# EAGLE design Adafruit Trellis 4x4 3mm HT16K33 (EAGLE 9.6.2)
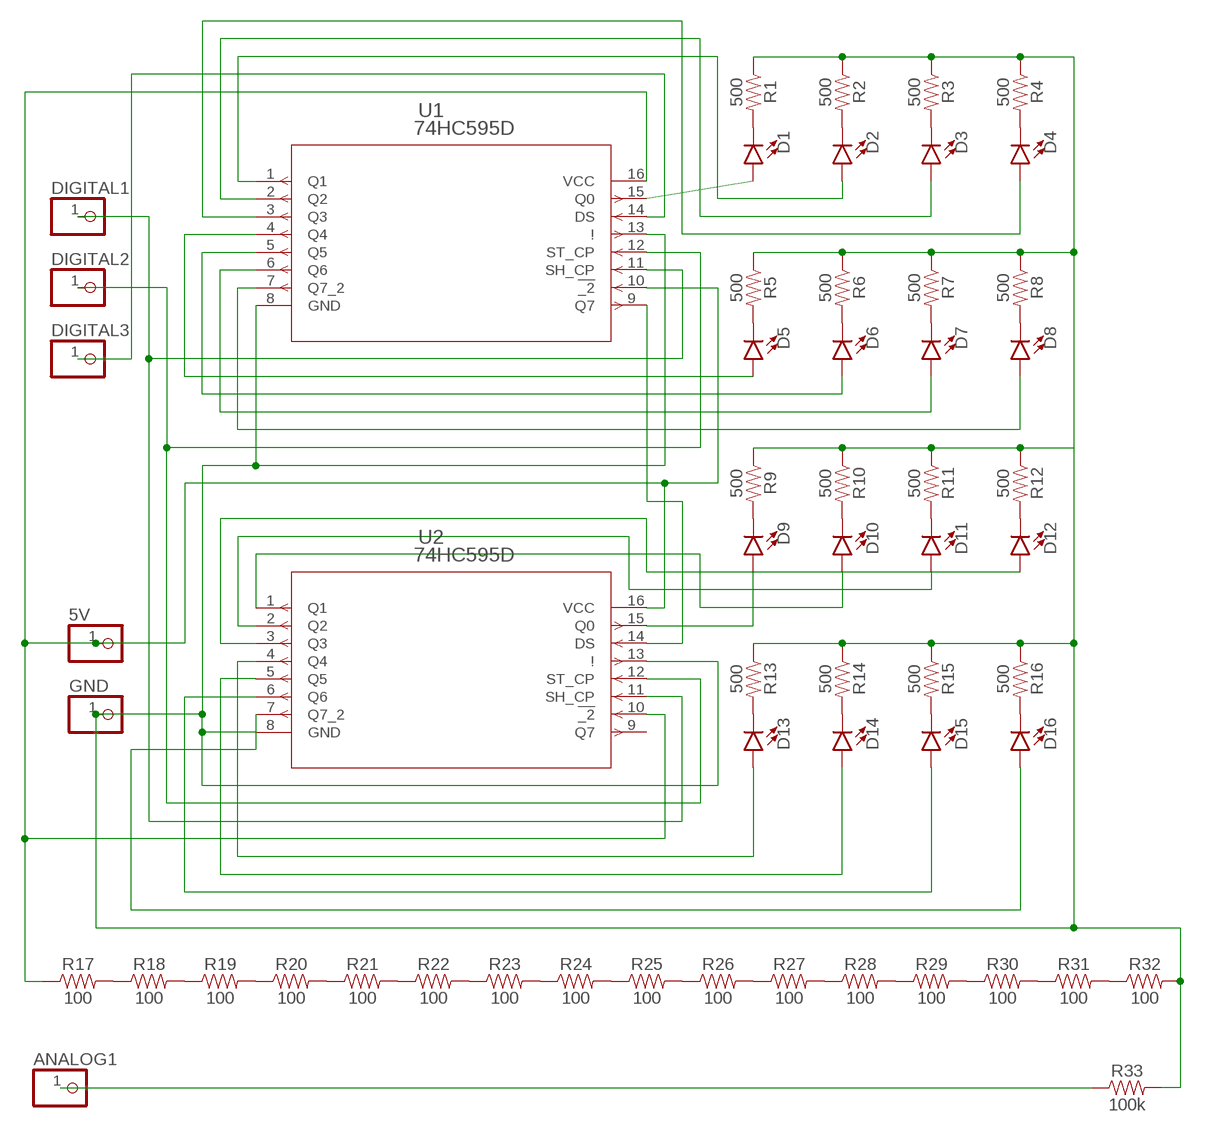
[diagram p0: schematic, sheet 1]

## Parts
5V  PINHD-1X1  [1X01]
ANALOG1  PINHD-1X1  [1X01]
D1  LED3MM  [LED_3MM]
D2  LED3MM  [LED_3MM]
D3  LED3MM  [LED_3MM]
D4  LED3MM  [LED_3MM]
D5  LED3MM  [LED_3MM]
D6  LED3MM  [LED_3MM]
D7  LED3MM  [LED_3MM]
D8  LED3MM  [LED_3MM]
D9  LED3MM  [LED_3MM]
D10  LED3MM  [LED_3MM]
D11  LED3MM  [LED_3MM]
D12  LED3MM  [LED_3MM]
D13  LED3MM  [LED_3MM]
D14  LED3MM  [LED_3MM]
D15  LED3MM  [LED_3MM]
D16  LED3MM  [LED_3MM]
DIGITAL1  PINHD-1X1  [1X01]
DIGITAL2  PINHD-1X1  [1X01]
DIGITAL3  PINHD-1X1  [1X01]
GND  PINHD-1X1  [1X01]
R1  500  RESISTOR0603  [0603]
R2  500  RESISTOR0603  [0603]
R3  500  RESISTOR0603  [0603]
R4  500  RESISTOR0603  [0603]
R5  500  RESISTOR0603  [0603]
R6  500  RESISTOR0603  [0603]
R7  500  RESISTOR0603  [0603]
R8  500  RESISTOR0603  [0603]
R9  500  RESISTOR0603  [0603]
R10  500  RESISTOR0603  [0603]
R11  500  RESISTOR0603  [0603]
R12  500  RESISTOR0603  [0603]
R13  500  RESISTOR0603  [0603]
R14  500  RESISTOR0603  [0603]
R15  500  RESISTOR0603  [0603]
R16  500  RESISTOR0603  [0603]
R17  100  100OHM-0603-1/10W-1%  [0603]
R18  100  100OHM-0603-1/10W-1%  [0603]
R19  100  100OHM-0603-1/10W-1%  [0603]
R20  100  100OHM-0603-1/10W-1%  [0603]
R21  100  100OHM-0603-1/10W-1%  [0603]
R22  100  100OHM-0603-1/10W-1%  [0603]
R23  100  100OHM-0603-1/10W-1%  [0603]
R24  100  100OHM-0603-1/10W-1%  [0603]
R25  100  100OHM-0603-1/10W-1%  [0603]
R26  100  100OHM-0603-1/10W-1%  [0603]
R27  100  100OHM-0603-1/10W-1%  [0603]
R28  100  100OHM-0603-1/10W-1%  [0603]
R29  100  100OHM-0603-1/10W-1%  [0603]
R30  100  100OHM-0603-1/10W-1%  [0603]
R31  100  100OHM-0603-1/10W-1%  [0603]
R32  100  100OHM-0603-1/10W-1%  [0603]
R33  100k  100KOHM-0603-1/10W-1%  [0603]
U1  74HC595D  [SOT109-1_NXP]
U2  74HC595D  [SOT109-1_NXP]

## Nets
N$1: R17.2 R18.1
N$2: ANALOG1.1 R33.1
N$3: DIGITAL3.1 U1.14(DS)
N$4: D11.A U2.2(Q2)
N$5: DIGITAL2.1 U1.12(ST_CP) U2.12(ST_CP)
N$6: D1.K(C) R1.2
N$7: D2.K(C) R2.2
N$8: GND.1 R1.1 R2.1 R3.1 R4.1 R5.1 R6.1 R7.1 R8.1 R9.1 R10.1 R11.1 R12.1 R13.1 R14.1 R15.1 R16.1 R32.2 R33.2 U1.8(GND) U1.13(!) U2.8(GND) U2.13(!)
N$9: D3.K(C) R3.2
N$10: D4.K(C) R4.2
N$11: D5.K(C) R5.2
N$12: D6.K(C) R6.2
N$13: D7.K(C) R7.2
N$14: D1.A U1.15(Q0)
N$15: D8.K(C) R8.2
N$16: D9.K(C) R9.2
N$17: D10.K(C) R10.2
N$18: D11.K(C) R11.2
N$19: D12.K(C) R12.2
N$20: D13.K(C) R13.2
N$21: D14.K(C) R14.2
N$22: D15.K(C) R15.2
N$23: D16.K(C) R16.2
N$24: D5.A U1.4(Q4)
N$25: D2.A U1.1(Q1)
N$26: D3.A U1.2(Q2)
N$27: D4.A U1.3(Q3)
N$28: U1.9(Q7) U2.14(DS)
N$29: D6.A U1.5(Q5)
N$30: D7.A U1.6(Q6)
N$31: D8.A U1.7(Q7_2)
N$32: D13.A U2.4(Q4)
N$33: D10.A U2.1(Q1)
N$35: 5V.1 R17.1 U1.10(!_2) U1.16(VCC) U2.10(!_2) U2.16(VCC)
N$36: D12.A U2.3(Q3)
N$37: R18.2 R19.1
N$38: D9.A U2.15(Q0)
N$39: D14.A U2.5(Q5)
N$40: R19.2 R20.1
N$41: D15.A U2.6(Q6)
N$42: R20.2 R21.1
N$43: R21.2 R22.1
N$44: R22.2 R23.1
N$45: R23.2 R24.1
N$46: R24.2 R25.1
N$47: R25.2 R26.1
N$48: R26.2 R27.1
N$49: R27.2 R28.1
N$50: R28.2 R29.1
N$51: R29.2 R30.1
N$52: R30.2 R31.1
N$53: R31.2 R32.1
N$54: D16.A U2.7(Q7_2)
N$55: DIGITAL1.1 U1.11(SH_CP) U2.11(SH_CP)
Unconnected: U2.9(Q7)

## Library data of the parts
5V ANALOG1 DIGITAL1-DIGITAL3 GND = adafruit:PINHD-1X1: Pin header 1x1 for 0.1" spacing With round pins
D1-D16 = SparkFun-LED:LED: LED (Generic) Standard schematic elements and footprints for 5mm, 3mm, 1206, and 0603 sized LEDs. Generic LEDs with no color specified.; PROD_ID: DIO-08794
R1-R16 = SparkFun-Resistors:RESISTOR: Generic Resistor Package
R17-R32 = SparkFun-Resistors:100OHM: 100Ω resistor A resistor is a passive two-terminal electrical component that implements electrical resistance as a circuit element. Resistors act to reduce current flow, and, at the same time, act to lower voltage levels within circuits. - Wikipedia; PROD_ID: RES-07863
R33 = SparkFun-Resistors:100KOHM: 100kΩ resistor A resistor is a passive two-terminal electrical component that implements electrical resistance as a circuit element. Resistors act to reduce current flow, and, at the same time, act to lower voltage levels within circuits. - Wikipedia; PROD_ID: RES-07828
U1 U2 = Shift_Register:74HC595D; COPYRIGHT: Copyright (C) 2022 Ultra Librarian. All rights reserved.; DIGI-KEY_PART_NUMBER_1: 1727-3796-ND; DIGI-KEY_PART_NUMBER_2: 568-1483-1-ND; DIGI-KEY_PART_NUMBER_3: 568-1483-2-ND; DIGI-KEY_PART_NUMBER_4: 568-1483-6-ND; DIGI-KEY_PART_NUMBER_5: 568-3968-5-ND; DIGI-KEY_PART_NUMBER_6: 74HC595DCT-ND; DIGI-KEY_PART_NUMBER_7: 74HC595DDKR-ND; DIGI-KEY_PART_NUMBER_8: 74HC595DTR-ND; MANUFACTURER_PART_NUMBER: 74HC595D; MFR_NAME: NXP

## Board
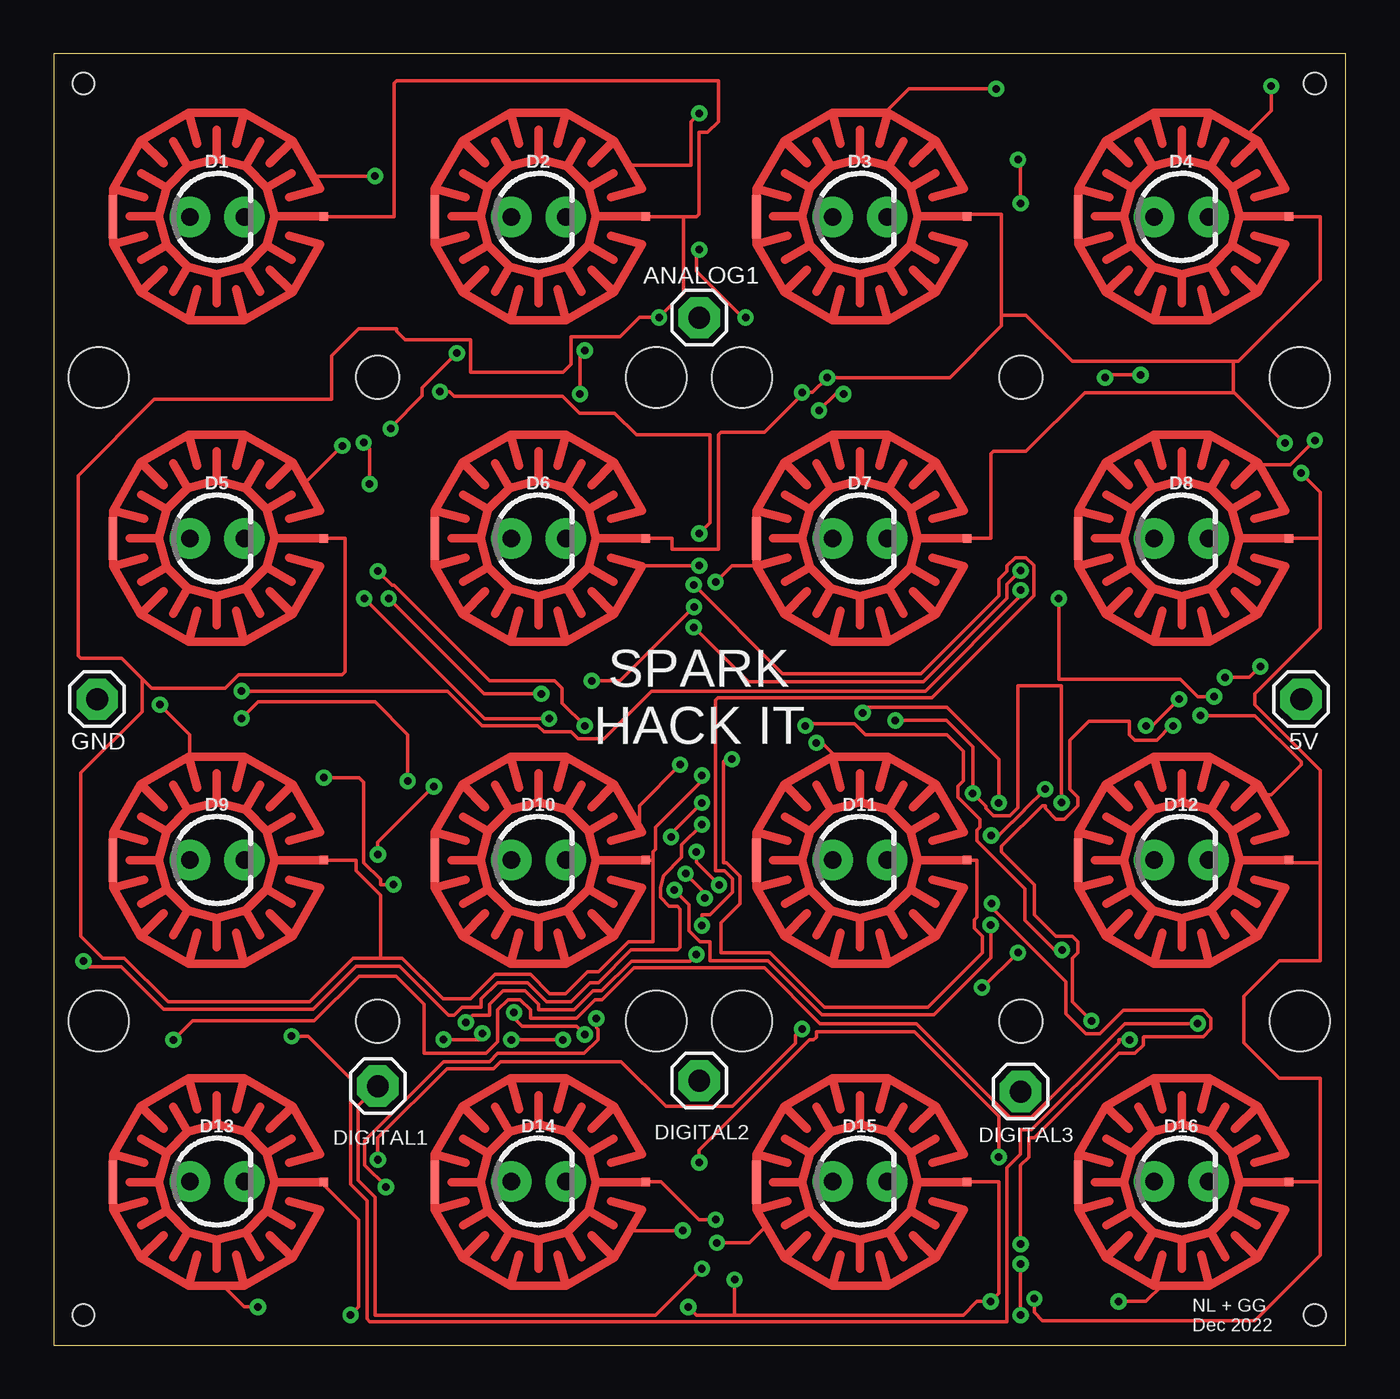
[diagram p1: board, top side]
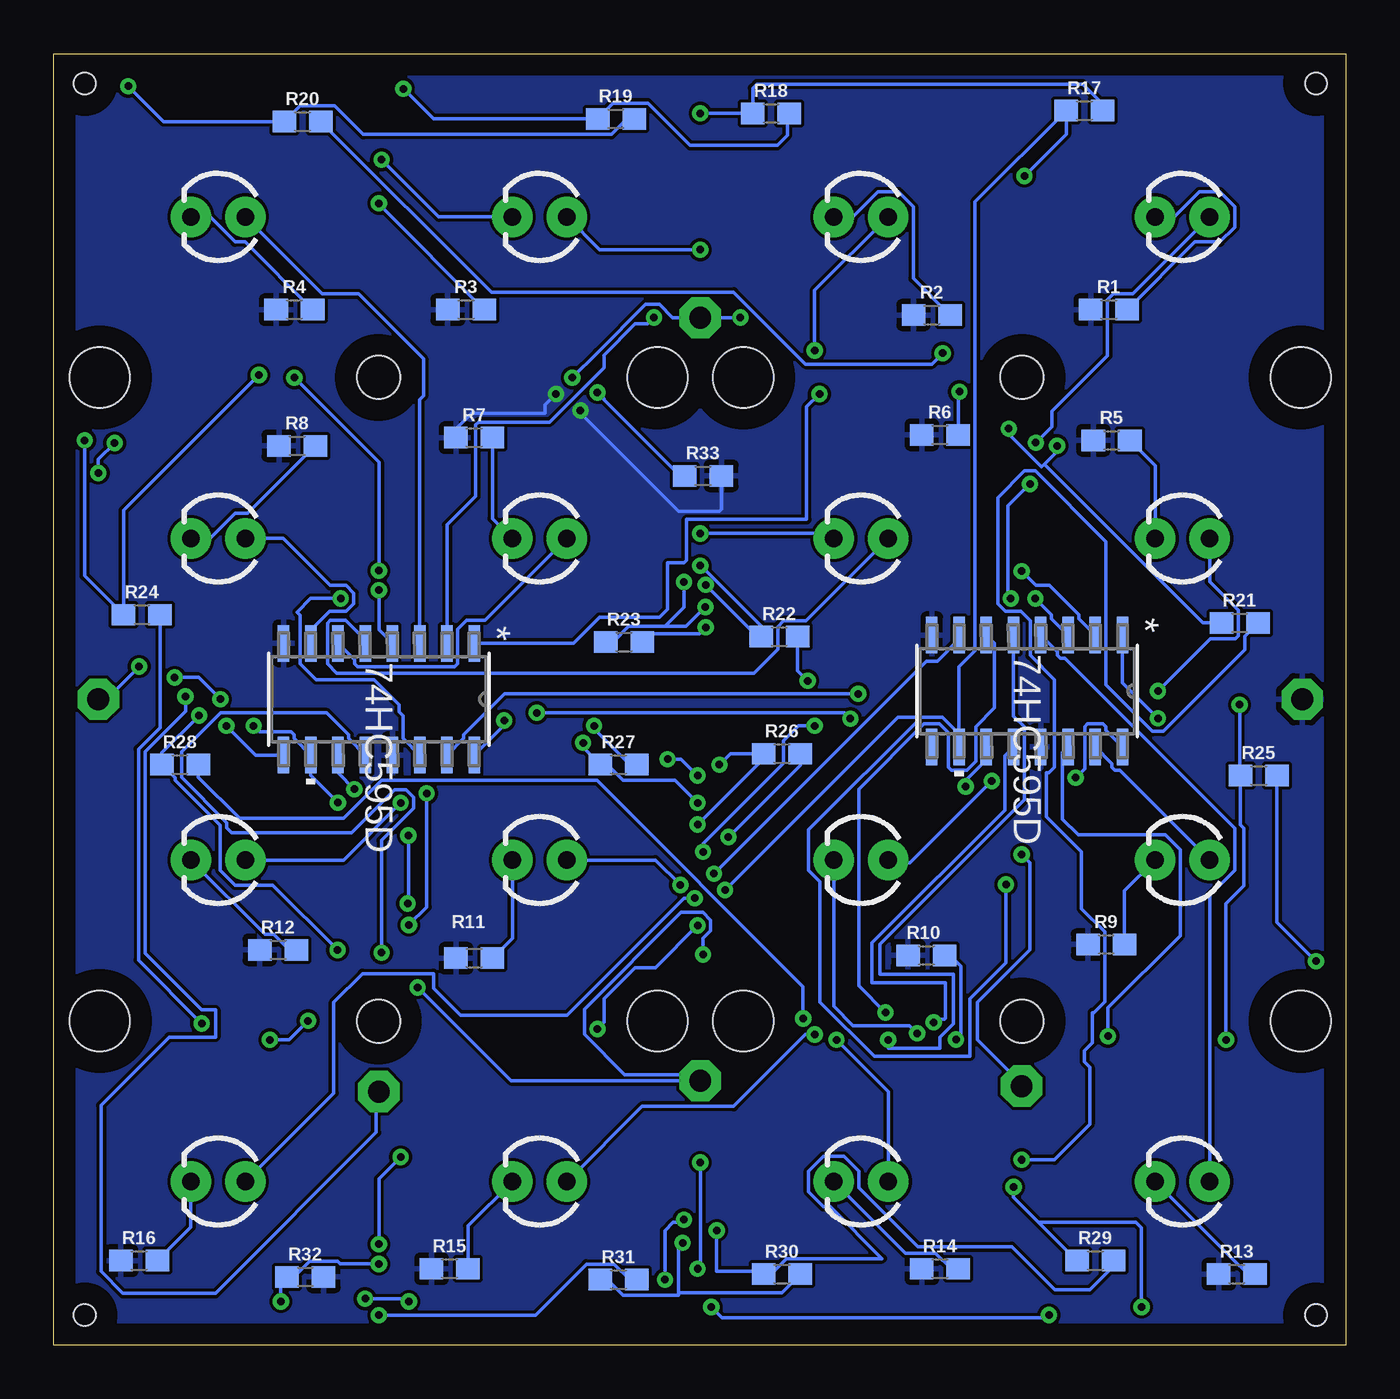
[diagram p2: board, bottom side, seen from below]

Size 60.25 x 60.19 mm. Coordinates in mm from the lower left corner, seen from the top.
Outline: 0,0 60.25,0 60.25,60.19 0,60.19 0,0
Copper layers (1*16): Top 0.035mm / dielectric 1.5mm / Bottom 0.035mm
Design rules "default": minimum track width 6mil, minimum drill 0.35mm, track to track 6mil, track to pad 6mil, pad to pad 6mil, via to via 6mil, smd to smd 6mil, copper to edge 40mil, drill to drill 6mil, minimum pad ring 10mil, minimum via ring 8mil, stop-mask expansion 4mil, vias tented up to drill 0mil, thermal gap 10mil

### Footprints (pad centres in the part's own frame; a part is rotated, then mirrored left to right if it is on the bottom)
1X01 = drill 1.016 pad 1.93 octagon: 1 0,0
LED_3MM = drill 0.813 pad 1.88: A -1.27,0; K 1.27,0
ELAST_PAD_SQUARE_10MM_5.4MM_4X4GRID = smd 0.4 x 0.4: A1 -17.5,-22.5; A2 -2.5,-22.5; A3 12.5,-22.5; A4 27.5,-22.5; A5 -17.5,-7.5; A6 -2.5,-7.5; A7 12.5,-7.5; A8 27.5,-7.5; A9 -17.5,7.5; A10 -2.5,7.5; A11 12.5,7.5; A12 27.5,7.5; A13 -17.5,22.5; A14 -2.5,22.5; A15 12.5,22.5; A16 27.5,22.5 | smd 0.4 x 2: B1 -27.33,-22.51; B2 -12.33,-22.51; B3 2.67,-22.51; B4 17.67,-22.51; B5 -27.33,-7.51; B6 -12.33,-7.51; B7 2.67,-7.51; B8 17.67,-7.51; B9 -27.33,7.49; B10 -12.33,7.49; B11 2.67,7.49; B12 17.67,7.49; B13 -27.33,22.49; B14 -12.33,22.49; B15 2.67,22.49; B16 17.67,22.49 | hole 2.8: -28,-15; -2,-15; 28,-15; -28,15; -2,15; 2,15; 28,15; 2,-15 | hole 1: -28.7,-28.7; 28.7,-28.7; 28.7,28.7; -28.7,28.7 | hole 2: -15,15; 15,15; 15,-15; -15,-15
0603 = smd 1.1 x 1: 1 -0.85,0; 2 0.85,0
SOT109-1_NXP = smd 1.702 x 0.533: 1 -2.603,4.445; 2 -2.603,3.175; 3 -2.603,1.905; 4 -2.603,0.635; 5 -2.603,-0.635; 6 -2.603,-1.905; 7 -2.603,-3.175; 8 -2.603,-4.445; 9 2.603,-4.445; 10 2.603,-3.175; 11 2.603,-1.905; 12 2.603,-0.635; 13 2.603,0.635; 14 2.603,1.905; 15 2.603,3.175; 16 2.603,4.445

### Placement (x,y rotation side)
5V  58.17,30.1 0 top
ANALOG1  30.1,47.88 0 top
D1  7.62,52.58 0 top
D2  22.61,52.58 0 top
D3  37.59,52.58 0 top
D4  52.58,52.58 0 top
D5  7.62,37.59 0 top
D6  22.61,37.59 0 top
D7  37.59,37.59 0 top
D8  52.58,37.59 0 top
D9  7.62,22.61 0 top
D10  22.61,22.61 0 top
D11  37.59,22.61 0 top
D12  52.58,22.61 0 top
D13  7.62,7.62 0 top
D14  22.61,7.62 0 top
D15  37.59,7.62 0 top
D16  52.58,7.62 0 top
DIGITAL1  15.11,12.06 0 top
DIGITAL2  30.1,12.32 0 top
DIGITAL3  45.08,11.81 0 top
E$1  [ELAST_PAD_SQUARE_10MM_5.4MM_4X4GRID]  30.1,30.1 0 top
GND  2.03,30.1 0 top
R1  11.05,48.26 0 bottom
R2  19.3,48.01 0 bottom
R3  41.02,48.26 0 bottom
R4  49.02,48.26 0 bottom
R5  10.92,42.16 0 bottom
R6  18.92,42.42 0 bottom
R7  40.64,42.29 0 bottom
R8  48.89,41.91 0 bottom
R9  11.18,18.67 0 bottom
R10  19.56,18.16 0 bottom
R11  40.64,18.03 0 bottom
R12  49.78,18.41 0 bottom
R13  5.08,3.3 0 bottom
R14  18.92,3.56 0 bottom
R15  41.78,3.56 0 bottom
R16  56.26,3.94 0 bottom
R17  12.19,57.53 0 bottom
R18  26.8,57.4 0 bottom
R19  34.04,57.15 0 bottom
R20  48.64,57.02 0 bottom
R21  4.95,33.66 0 bottom
R22  26.42,33.02 0 bottom
R23  33.66,32.77 0 bottom
R24  56.13,34.04 0 bottom
R25  4.06,26.54 0 bottom
R26  26.29,27.56 0 bottom
R27  33.91,27.05 0 bottom
R28  54.36,27.05 0 bottom
R29  11.68,3.94 0 bottom
R30  26.29,3.3 0 bottom
R31  33.91,3.05 0 bottom
R32  48.51,3.17 0 bottom
R33  29.97,40.51 0 bottom
U1  45.08,30.1 270 bottom
U2  14.86,30.48 270 bottom

### Tracks (layer width: path | path; a pad name or v marks a point on that pad's centre or on a via)
N$1  (via drill 0.35)
  Top 0.152: v30.1,57.4 29.72,57.02 29.72,54.99 26.8,54.99
  Bottom 0.152: R17.2 11.34,57.84 12.27,58.77 27.46,58.77 27.65,58.59 R18.1 v30.1,57.4
N$2  (via drill 0.35)
  Top 0.152: 29.37,52.58 29.37,49.04 v28.23,47.89 27.32,47.89 26.42,46.99 24.13,46.99 24.13,45.72 23.75,45.34 19.43,45.34 19.43,46.86 16.38,46.86 16,47.24 16,47.37 14.22,47.37 12.95,46.1 12.95,44.07 4.7,44.07 1.14,40.51 1.14,32.13 1.27,32 3.18,32 4.13,31.05 | 11.94,52.58 15.88,52.58 15.88,58.8 16,58.93 30.99,58.93 30.99,57.02 30.48,56.52 30.1,56.52 30.1,52.7 29.97,52.58 29.37,52.58 | 44.2,48.01 44.2,47.5 41.78,45.09 v36.07,45.09 35.38,44.4 v34.89,44.4 34.89,44.29 33.15,42.55 31.11,42.55 30.99,42.42 30.99,37.08 28.83,37.08 28.83,37.59 27.18,37.59 | 44.2,48.01 44.2,52.7 42.16,52.7 | 44.2,48.01 45.34,48.01 47.5,45.85 54.99,45.85 | 54.99,45.85 55.24,45.85 59.05,49.66 59.05,52.58 57.15,52.58 | 54.99,45.85 54.99,44.45 55.05,44.39 | 55.05,44.39 v57.4,42.04 | v58.17,40.64 59.05,39.75 59.05,37.59 | 59.05,37.59 57.15,37.59 | 55.05,44.39 48.07,44.39 45.34,41.66 43.81,41.66 43.69,41.53 43.69,37.59 42.04,37.59 | 4.13,31.05 4.57,30.61 8,30.61 8.64,31.24 13.46,31.24 13.59,31.37 13.59,37.59 12.19,37.59 | 4.13,31.05 4.13,29.53 1.27,26.67 1.27,19.05 2.29,18.03 3.3,18.03 5.33,16 11.94,16 13.97,18.03 15.24,18.03 | 11.94,22.61 14.1,22.61 14.1,22.1 15.24,20.95 15.24,18.03 | 15.24,18.03 16.26,18.03 18.16,16.13 19.43,16.13 20.57,17.27 22.22,17.27 23.11,16.38 23.88,16.38 24.89,17.4 25.4,17.4 26.8,18.8 27.94,18.8 27.94,22.61 | 27.94,22.61 27.05,22.61 | 27.94,22.61 27.94,22.99 28.07,23.11 28.07,24.13 30.23,26.29 v30.23,26.54 | v31.62,27.3 31.37,27.3 31.24,27.18 31.24,22.48 31.37,22.48 32,21.84 32,20.57 31.11,19.69 31.11,18.29 33.4,18.29 35.94,15.75 40.77,15.75 43.31,18.29 43.31,19.05 42.93,19.43 42.93,19.81 43.05,19.94 43.05,22.61 42.04,22.61
  Top 0.152: 59.05,37.59 59.05,33.4 56.01,30.35 56.01,29.84 59.05,26.8 59.05,22.48 | 59.05,22.48 57.15,22.48 | 59.05,22.48 59.05,17.91 57.15,17.91 55.5,16.26 55.5,14.1 57.15,12.45 59.05,12.45 59.05,7.62 | 59.05,7.62 57.02,7.62 | 59.05,7.62 59.05,4.19 56.01,1.14 46.1,1.14 45.72,1.52 v45.72,2.16 | 42.16,7.62 44.07,7.62 44.07,2.41 v43.69,2.03 43.05,2.03 42.42,1.4 31.75,1.4 | 31.75,1.4 v31.75,3.05 | v30.86,5.84 30.1,5.84 28.32,7.62 27.18,7.62 | 31.75,1.4 29.97,1.4 v29.59,1.78 | 12.45,7.62 14.22,5.84 14.22,1.78 v13.84,1.4 | 29.37,52.58 26.92,52.58
  Bottom 0.152: v36.07,45.09 34.9,46.26 32.65,48.5 32.01,48.5 31.39,47.88 ANALOG1.1 28.24,47.88 v28.23,47.89 | v34.89,44.4 34.59,44.1 34.59,44.07 31.04,40.51 R33.1 | v57.4,42.04 58.17,41.27 v58.17,40.64 | v30.23,26.54 30.99,27.3 v31.62,27.3 | v43.69,2.03 43.81,2.03 43.94,2.16 v45.72,2.16 | v31.75,3.05 31.75,5.33 31.37,5.71 30.86,5.71 v30.86,5.84 | v29.59,1.78 29.08,1.27 13.84,1.27 v13.84,1.4
N$3  (via drill 0.35)
  Top 0.152: v46.86,34.8 46.86,31.04 52.53,31.04 53.34,30.23 v54.1,30.23
  Bottom 0.152: U1.14 43.95,28.27 43.95,29.34 44.14,29.53 44.14,29.84 45.31,31.01 48.01,31.01 48.75,31.76 48.75,34.02 48.89,34.16 48.26,34.8 v46.86,34.8 | DIGITAL3.1 45.21,11.81 45.21,9.91 52.7,2.41 57.02,2.41 58.04,3.43 58.04,11.18 54.86,14.35 52.7,14.35 52.7,15.62 53.34,15.62 55.98,18.27 55.98,27.65 54.1,29.53 v54.1,30.23
N$4  (via drill 0.35)
  Top 0.152: v29.97,22.99 29.97,22.49 v31.02,21.44 | v24.77,28.86 23.71,29.91 23.71,30.62 23.36,30.96 20.32,30.96 15.87,35.41 15.78,35.41 v15.11,36.07
  Bottom 0.152: D11.A 32.19,22.61 v31.02,21.44 | v29.97,22.99 29.97,23.35 26.22,27.11 26.22,28.15 25.51,28.86 v24.77,28.86 | v15.11,36.07 14.45,35.41 13.83,35.41 12.46,34.03 12.46,33.86 U2.2
N$5  (via drill 0.35)
  Top 0.152: v44.96,18.29 43.33,16.66 v43.28,16.66 | v29.97,18.2 29.67,17.9 26.94,17.9 25.55,16.51 25.15,16.51 24.26,15.62 22.61,15.62 22.61,15.87 21.97,16.51 20.96,16.51 20.32,15.87 20.32,15.37 19.54,15.37 v19.22,15.04
  Bottom 0.152: v44.96,18.29 44.96,23.53 43.46,25.02 43.46,25.52 43.82,25.88 44.35,25.88 46.36,23.88 51.94,23.88 52.17,24.11 52.17,24.34 54.28,26.46 54.28,27.65 52.47,29.46 47.52,29.46 46.49,28.44 46.49,28.27 U1.12 | v43.28,16.66 38.93,12.32 DIGITAL2.1 30.39,12.61 33.63,12.61 35.5,14.48 35.5,15.65 30.99,20.16 29.97,20.16 29.62,19.81 29.62,19.31 29.97,18.95 v29.97,18.2 | U2.12 15.9,27.47 15.9,24.93 22.1,18.74 22.1,16.89 18.67,16.89 18.67,15.24 18.72,15.18 19.36,15.18 v19.22,15.04
N$6
  Bottom 0.152: R1.2 7.05,51.41 5.87,51.41 5.18,52.09 5.18,53.06 5.87,53.75 6.83,53.75 8,52.58 D1.K
N$7
  Bottom 0.152: D2.K 22.99,52.58 21.82,53.75 20.85,53.75 20.17,53.06 20.17,49.72 R2.2
N$8  (via drill 0.35)
  Top 0.152: v35.69,43.56 36.45,44.32 v36.83,44.32
  Bottom 0.152: R33.2 29.12,38.95 29.21,38.86 31.11,38.86 35.69,43.43 v35.69,43.56 | v36.83,44.32 37.34,43.82 37.34,43.43 40.77,43.43 41.49,42.71 R7.1
  pour Bottom: 0.13,0.13 60.07,0.13 60.07,60.07 0.13,60.07
N$9  (via drill 0.35)
  Top 0.152: v44.96,55.24 45.08,55.12 v45.08,53.21
  Bottom 0.152: D3.K 42.29,52.58 v44.96,55.24 | v45.08,53.21 45.08,53.17 R3.2
N$10
  Bottom 0.152: R4.2 51.32,51.41 51.79,51.41 52.96,52.58 D4.K
N$11
  Bottom 0.152: D5.K 8.89,40.98 R5.2
N$12  (via drill 0.35)
  Top 0.152: v18.01,44.43 18.47,44.43 18.67,44.22 23.72,44.22 24.51,43.43 26.16,43.43 27.18,42.42 30.61,42.42 30.61,38.33 v30.1,37.83
  Bottom 0.152: R6.2 18.07,44.37 v18.01,44.43 | v30.1,37.83 24.11,37.83 D6.K
N$13
  Bottom 0.152: R7.2 39.79,38.52 D7.K
N$14  (via drill 0.35)
  Top 0.152: v14.73,40.13 14.73,41.78 v14.46,42.06 | v15.62,34.8 20.07,30.35 v22.73,30.35
  Bottom 0.152: D1.A 9.94,48.99 10.84,48.99 11.12,48.71 11.12,46.12 13.72,43.52 13.72,42.8 v14.46,42.06 | v14.73,40.13 15.75,39.12 15.75,34.93 v15.62,34.8 | U1.15 41.14,28.27 41.14,28.44 39.22,30.35 v22.73,30.35
N$15
  Bottom 0.152: R8.2 51.19,38.76 51.79,38.76 52.96,37.59 D8.K
N$16
  Bottom 0.152: D9.K 10.33,21.17 R9.2
N$17  (via drill 0.35)
  Top 0.152: v19.99,14.53 19.99,14.22 18.19,14.22 v18.18,14.24
  Bottom 0.152: D10.K 23.88,15.78 22.98,14.89 20.35,14.89 v19.99,14.53 | R10.2 18.45,18.16 17.95,17.65 17.95,14.47 v18.18,14.24
N$18
  Bottom 0.152: R11.2 38.86,18.96 D11.K
N$19
  Bottom 0.152: D12.K 50.39,19.14 49.99,19.14 49.26,18.41 R12.2
N$20
  Bottom 0.152: D13.K 5.3,4.03 5.29,4.03 4.56,3.3 R13.2
N$21
  Bottom 0.152: D14.K 20.54,4.29 19.13,4.29 18.4,3.56 R14.2
N$22
  Bottom 0.152: D15.K 40.93,5.55 R15.2
N$23
  Bottom 0.152: D16.K 53.85,5.5 R16.2
N$24  (via drill 0.35)
  Top 0.152: v45.08,35.18 45.08,34.93 40.64,30.48 27.88,30.48 25.65,28.25 24.46,28.25 24.13,28.58 22.86,28.58 22.57,28.87 19.98,28.87 18.36,30.48 v8.76,30.48
  Bottom 0.152: D5.A 6.35,35.58 5.02,34.25 5.02,33.06 5.16,32.93 6.32,32.93 v8.76,30.48 | v45.08,35.18 45.08,33.34 U1.4
N$25  (via drill 0.35)
  Top 0.152: v24.77,46.36 24.54,46.13 v24.54,44.32
  Bottom 0.152: D2.A 24.77,49.15 v24.77,46.36 | U1.1 36,32.7 34.8,33.91 32,33.91 31.62,34.29 31.62,36.45 30.86,36.45 30.73,36.58 30.73,38.48 25.15,38.48 25.15,43.72 v24.54,44.32
N$26  (via drill 0.35)
  Top 0.152: v32.26,47.89 32.12,47.89 29.97,50.04 29.97,50.93 v30.1,51.05
  Bottom 0.152: D3.A 34.8,51.05 v30.1,51.05 | U1.2 41.91,38.23 40.57,39.57 40.57,42.89 40.44,43.02 37.13,43.02 34.59,45.56 34.59,46.13 33.13,47.59 32.56,47.59 v32.26,47.89
N$27
  Bottom 0.152: D4.A 47.72,48.99 46.03,48.99 43.01,45.97 43.01,44.23 43.18,44.06 U1.3
N$28  (via drill 0.35)
  Top 0.152: v50.16,14.22 49.66,14.22 49.66,14.1 45.59,10.03 45.08,10.03 45.08,8.89 44.45,8.26 44.45,1.09 14.73,1.09 14.61,1.22 14.61,6.73 13.84,7.49 13.84,12.41 11.86,14.4 v11.1,14.4 | v48.39,15.11 47.5,16 47.5,18.03 47.75,18.29 47.75,18.8 47.5,19.05 46.74,19.05 45.72,20.07 45.72,21.46 44.2,22.99 44.2,23.24 46.1,25.15 46.23,25.15 46.23,25.02 46.74,24.51 47.12,24.51 47.75,25.15 47.75,25.53 47.37,25.91 47.37,28.19 48.26,29.08 50.16,29.08 50.16,28.45 50.42,28.19 51.44,28.19 52.1,28.86 v52.2,28.86
  Bottom 0.152: U1.9 50.83,27.5 v52.2,28.86 | v48.39,15.11 49.28,14.22 v50.16,14.22 | v11.1,14.4 11.1,15.71 7.72,19.09 7.72,23.09 8.41,23.77 12.47,23.77 13.21,24.51 13.21,27.62 U2.14
N$29
  Bottom 0.152: D6.A 25.18,33.75 26.21,33.75 26.49,33.47 26.49,32.43 27.6,31.32 47.05,31.32 47.48,31.76 47.48,33.65 47.35,33.78 46.63,33.78 45.72,32.87 U1.5
N$30
  Bottom 0.152: D7.A 40.13,33.78 41,33.78 41.42,33.37 41.42,31.76 41.55,31.62 46.08,31.62 46.22,31.76 46.22,31.93 U1.6
N$31
  Bottom 0.152: D8.A 49.55,37.59 47.36,35.41 46.61,35.41 46.26,35.05 46.26,34.55 46.61,34.19 47.37,34.19 48.26,33.3 U1.7
N$32
  Bottom 0.152: U2.4 13.45,32.31 13.45,32.14 13.32,32 13.1,32 5.18,24.09 5.18,22.12 6.35,20.95 D13.A
N$33  (via drill 0.35)
  Top 0.152: v16.51,26.29 16.51,28.45 14.99,29.97 9.53,29.97 v8.76,29.21
  Bottom 0.152: D10.A 21.21,22.48 20.32,22.48 v16.51,26.29 | v8.76,29.21 10.41,30.86 U2.1
N$35  (via drill 0.35)
  Top 0.152: v52.47,30.1 51.23,28.86 v50.93,28.86 | v12.6,26.44 14.25,26.44 14.46,26.24 14.46,22.48 15.24,21.7 15.24,21.46 v15.85,21.46 | v43.69,19.58 43.69,18.05 41.05,15.4 35.81,15.4 33.31,17.91 30.61,17.91 30.61,18.8 30.13,18.8 29.62,19.31 29.62,20.53 v28.94,21.2 | v39.24,29.11 41.62,29.11 42.86,27.88 v42.86,25.72 43.46,25.11 43.46,25.02 43.82,24.67 44.57,24.67 44.96,25.05 44.96,30.73 46.99,30.73 v46.99,25.28 | v14.99,54.48 12.07,54.48 | v54.61,31.12 55.75,31.12 v56.26,31.62
  Bottom 0.152: v50.93,28.86 50.64,28.58 49.17,28.58 49.03,28.44 49.03,28.27 U1.10 48.26,26.55 v46.99,25.28 | U2.16 11.19,28.65 11.19,28.82 11.32,28.96 12.04,28.96 12.18,28.82 12.18,26.87 v12.6,26.44 | 19.79,29.26 25.04,24.01 25.04,22.12 24.51,21.59 24.51,15.98 21.99,13.46 17.53,13.46 17.53,16.13 15.85,17.81 v15.85,21.46 | 19.79,29.26 18.82,29.26 18.22,28.67 18.22,28.07 U2.10 18.03,31.62 17.29,32.36 17.29,53.28 R17.1 13.04,56.43 v14.99,54.48 | 19.79,29.26 20.89,29.26 v28.94,21.2 | v43.69,19.58 42.86,20.41 v42.86,25.72 | v39.24,29.11 39.24,28.89 U1.16 | v52.47,30.1 53.49,31.12 v54.61,31.12 | v56.26,31.62 57.78,30.1 5V.1
N$36  (via drill 0.35)
  Top 0.152: v44.07,25.27 44.07,27.3 41.66,29.72 37.97,29.72 v37.72,29.46 | v23.1,29.19 20.09,29.19 v14.48,34.8
  Bottom 0.152: D12.A 46.74,22.61 v44.07,25.27 | v37.72,29.46 23.38,29.46 v23.1,29.19 | U2.3 13.73,33.86 13.73,34.03 14.48,34.78 v14.48,34.8
N$37  (via drill 0.35)
  Top 0.152: v43.94,58.55 39.88,58.55 38.73,57.4
  Bottom 0.152: R18.2 26.04,57.4 26.04,56.39 26.51,55.91 30.58,55.91 32.54,57.88 34.16,57.88 R19.1 42.55,57.15 v43.94,58.55
N$38
  Bottom 0.152: D9.A 10.54,26.8 10.78,26.8 10.91,26.93 10.91,27.1 U2.15
N$39  (via drill 0.35)
  Top 0.152: v23.75,14.22 v21.34,14.22
  Bottom 0.152: D14.A 21.34,11.81 v23.75,14.22 | U2.5 15.49,29.32 15,28.82 15,25.41 21.72,18.69 21.72,17.27 18.29,17.27 18.29,14.99 18.92,14.35 18.92,13.84 21.34,13.84 v21.34,14.22
N$40  (via drill 0.35)
  Top 0.152: v56.77,58.67 56.77,57.53 55.63,56.39
  Bottom 0.152: R19.2 33.51,57.15 34.24,56.42 45.82,56.42 47.15,57.75 48.76,57.75 R20.1 55.12,57.02 v56.77,58.67
N$41  (via drill 0.35)
  Top 0.152: v24.77,14.48 24.38,14.86 21.84,14.86 21.59,15.11 21.59,15.24 21.46,15.37 v21.46,15.49
  Bottom 0.152: v21.46,15.49 22.71,16.74 22.71,25.91 19.67,28.96 18.94,28.96 18.53,28.54 18.53,26.93 18.39,26.8 17.67,26.8 17.26,27.21 17.26,28.82 16.38,29.7 16.38,32.7 U2.6 | v24.77,14.48 25.2,14.48 28.55,11.12 32.82,11.12 D15.A
N$42  (via drill 0.35)
  Top 0.152: v18.8,46.23 17.19,44.62 17.19,44.23 15.71,42.75 v15.71,42.71 | v13.46,41.91 11.68,40.13
  Bottom 0.152: R20.2 39.84,49.07 28.55,49.07 25.2,45.72 19.3,45.72 v18.8,46.23 | v15.71,42.71 15.71,42.45 14.19,40.93 14.06,41.06 | 14.06,41.06 6.66,33.66 R21.1 | 14.06,41.06 13.46,41.66 v13.46,41.91
N$43  (via drill 0.35)
  Top 0.152: v34.89,14.73 34.59,14.43 34.59,14.07 31.65,11.12 28.55,11.12 26.46,13.21 20.83,13.21 20.51,12.89 18.35,12.89 15.11,9.65 v15.11,8.64 | v30.23,19.56 30.23,20.07 30.61,20.07 31.65,21.1 31.65,21.74 31.29,22.1 30.86,22.1 30.86,30.06 30.98,30.18 40.94,30.18 45.69,34.93 45.69,36.34 45.34,36.7 44.83,36.7 44.45,36.31 44.45,36.07 44.07,35.69 44.07,34.93 40.44,31.29 33.98,31.29 v29.85,35.43 | v30.1,36.32 27.31,36.32
  Bottom 0.152: R21.2 4.72,33.04 4.72,32.4 8.51,28.6 9.01,28.6 11.19,30.78 11.19,37.45 14.48,40.74 14.98,40.74 16.23,39.49 16.23,34.55 15.87,34.19 15.16,34.19 14.72,33.75 14.72,32.14 13.59,31.01 13.59,26.92 13.84,26.67 13.97,26.67 13.97,24.63 12.32,22.99 12.32,20.34 11.25,19.26 11.25,15.99 11.75,15.49 11.81,15.49 11.81,14.1 12.19,13.72 12.19,13.21 11.94,12.95 11.94,10.29 13.59,8.64 v15.11,8.64 | v34.89,14.73 34.59,15.03 34.59,16.13 33.13,17.59 32.19,17.59 v30.23,19.56 | v29.85,35.43 27.43,33.02 R22.1 27.27,33.53 30.06,36.32 v30.1,36.32
N$44  (via drill 0.35)
  Top 0.152: v29.86,34.4 26.42,30.96 v25.09,30.96 | v30.86,35.56 31.62,36.32 32.77,36.32
  Bottom 0.152: R23.1 34.18,32.77 33.45,33.5 31.75,33.5 | v29.86,34.4 30.77,33.5 31.75,33.5 | v25.09,30.96 25.57,31.44 R22.2 | 31.75,33.5 30.86,34.38 v30.86,35.56
N$45  (via drill 0.35)
  Top 0.152: v50.67,45.21 49.15,45.21 v49.02,45.09 | v29.85,33.45 32.39,30.91 40.56,30.91 44.45,34.8 44.45,35.45 v45.08,36.09 | v58.8,42.16 57.66,41.02 56.13,41.02
  Bottom 0.152: v50.67,45.21 56.98,38.9 R24.1 58.8,35.85 v58.8,42.16 | v49.02,45.09 45.08,41.15 v45.08,36.09 45.08,36.07 | v29.85,33.45 30.15,33.15 32.42,33.15 R23.2
N$46  (via drill 0.35)
  Top 0.152: v53.34,14.99 49.95,14.99 45.58,10.62 44.59,10.62 40.22,14.99 35.74,14.99 33.13,17.59 27.07,17.59 25.58,16.1 25.25,16.1 24.38,15.24 22.22,15.24 22.22,15.62 21.75,16.1 21.18,16.1 20.7,15.62 20.7,14.13 20.16,13.59 17.27,13.59 17.27,15.88 15.97,17.19 14.23,17.19 12.15,15.11 6.48,15.11 v5.59,14.22 | v4.95,29.84 6.35,28.45 6.35,27.3
  Bottom 0.152: R24.2 55.28,28.78 56.29,27.77 56.29,17.94 v53.34,14.99 | v5.59,14.22 5.59,20.57 4.75,21.41 4.75,24.08 4.91,24.25 R25.1 4.95,26.58 v4.95,29.84
N$47  (via drill 0.35)
  Top 0.152: v1.39,17.89 1.65,17.64 3.16,17.64 5.14,15.66 12.1,15.66 14.1,17.65 16.13,17.65 18.42,15.37 18.67,15.37 19.05,15.75 19.94,15.75 19.94,16.13 20.7,16.89 22.1,16.89 22.99,16 24.13,16 25.02,16.89 25.4,16.89 26.92,18.41 29.08,18.41 29.21,18.54 29.21,20.32 29.08,20.45 28.7,20.45 28.29,20.86 28.29,21.31 28.44,21.88 29.29,22.72 29.29,23.32 v30.23,24.26 | v29.21,27.05 27.31,25.15 27.31,24
  Bottom 0.152: R25.2 3.21,19.71 v1.39,17.89 | v30.23,24.26 27.14,27.34 R26.1 28.7,27.56 v29.21,27.05
N$48  (via drill 0.35)
  Top 0.152: v30.23,25.27 28.79,23.84 v28.79,23.68 | v35.56,28.07 35.81,28.07 36.45,27.43
  Bottom 0.152: v28.79,23.68 25.44,27.03 R26.2 | v30.23,25.27 31.28,26.32 33.7,26.32 34.43,27.05 R27.1 35.56,27.85 v35.56,28.07
N$49  (via drill 0.35)
  Top 0.152: v47.01,18.41 46.67,18.41 45.29,19.79 45.29,21.26 43.05,23.5 43.05,24 43.18,24.13 43.18,24.51 42.16,25.53 42.16,26.04 42.42,26.29 42.42,27.69 41.66,28.45 37.85,28.45 37.34,28.96 35.15,28.96 v35.05,28.86 | v53.47,29.34 56.01,29.34 58.17,27.18 58.17,27.05 56.77,25.65 56.39,25.65
  Bottom 0.152: R27.2 33.39,27.05 35.05,28.72 v35.05,28.86 | v47.01,18.41 50.03,21.44 51.79,21.44 52.48,22.12 52.48,24.22 54.59,26.33 54.59,26.43 R28.1 55.21,27.6 v53.47,29.34
N$50  (via drill 0.35)
  Top 0.152: v25.31,15.22 25.31,14.8 25.37,14.73 25.37,14.23 24.73,13.59 20.7,13.59 20.32,13.21 18.19,13.21 14.51,9.52 14.51,8.38 15.49,7.4 v15.49,7.37 | v9.53,1.78 8.89,1.78 7.87,2.79
  Bottom 0.152: R28.2 53.51,26.48 51.58,24.54 46.74,24.54 44.96,26.32 34.92,26.32 25.31,16.71 v25.31,15.22 | v15.49,7.37 15.49,6.9 14.33,5.73 | 14.33,5.73 R29.1 | 14.33,5.73 9.8,5.73 9.53,5.46 v9.53,1.78
N$51  (via drill 0.35)
  Top 0.152: v29.34,5.33 27.05,5.33 26.92,5.46
  Bottom 0.152: R29.2 10.83,3.68 11.94,2.57 13.56,2.57 15.58,4.59 19.96,4.59 22.71,7.34 22.71,8.1 23.39,8.79 24.36,8.79 25.04,8.1 25.04,7.14 24.36,6.45 24.04,6.45 21.62,4.03 26.08,4.03 26.81,3.3 R30.1 27.27,3.43 29.34,3.43 v29.34,5.33
N$52  (via drill 0.35)
  Top 0.152: v30.92,4.76 32.45,4.76 33.15,5.46 33.15,5.59
  Bottom 0.152: R31.1 34.43,3.05 33.7,2.32 31.11,2.32 31.11,2.45 | 31.11,2.45 26.29,2.45 R30.2 | 31.11,2.45 31.11,4.45 30.86,4.7 v30.92,4.76
N$53  (via drill 0.35)
  Top 0.152: v45.08,3.78 v45.08,1.39 | v49.66,2.03 50.93,2.03 51.69,2.79
  Bottom 0.152: v45.08,3.78 46.9,3.78 47.02,3.9 48.31,3.9 49.04,3.17 R32.1 49.66,2.88 v49.66,2.03 | v45.08,1.39 37.79,1.39 35.4,3.78 34.11,3.78 33.39,3.05 R31.2
N$54  (via drill 0.35)
  Top 0.152: v30.35,20.83 30.35,21.08 v29.46,21.97
  Bottom 0.152: D16.A 47.19,11.74 47.19,15.97 45.85,17.3 42.55,17.3 42.55,16.64 41.28,15.37 36.32,15.37 30.86,20.83 v30.35,20.83 | v29.46,21.97 19.56,31.88 19.05,31.88 18.03,32.89 U2.7
N$55  (via drill 0.35)
  Top 0.152: v17.72,26.04 15.11,23.42 v15.11,22.86 | v46.23,25.91 45.26,24.94 45.26,24.92 44.7,24.36 44.68,24.36 44.07,23.75 v43.7,23.75 | v43.74,20.57 43.74,20.38 47.19,16.93 47.19,15.45 48.14,14.51 48.78,14.51 49.87,15.59 53.59,15.59 53.95,15.24 53.95,14.74 53.59,14.38 50.83,14.38 50.8,14.35 50.8,13.97 50.42,13.59 49.66,13.59 45.72,9.65 45.47,9.65 45.47,8.76 45.08,8.38 v45.08,4.7 | v30.1,8.51 30.1,9.09 35.23,14.22 35.43,14.22 35.56,14.35 35.56,14.6 40.13,14.6 44.07,10.67 v44.07,8.76 | v30.23,3.56 28.07,1.4 14.99,1.4 14.99,6.89 14.2,7.67 14.2,11.15 DIGITAL1.1
  Bottom 0.152: DIGITAL1.1 15.11,12.15 17.19,14.23 17.19,15.97 14.73,18.42 14.73,22.48 v15.11,22.86 | U2.11 16.95,27.69 16.95,27.08 17.72,26.32 v17.72,26.04 | U1.11 46.99,26.67 v46.23,25.91 | v43.7,23.75 43.7,20.61 v43.74,20.57 | v45.08,4.7 45.08,7.75 v44.07,8.76 | v30.1,8.51 30.1,3.68 v30.23,3.56

### Text on the board
tPlace: SPARK / HACK IT | NL + GG / Dec 2022